# EAGLE design lamp_board_simple (EAGLE 7.2.0)
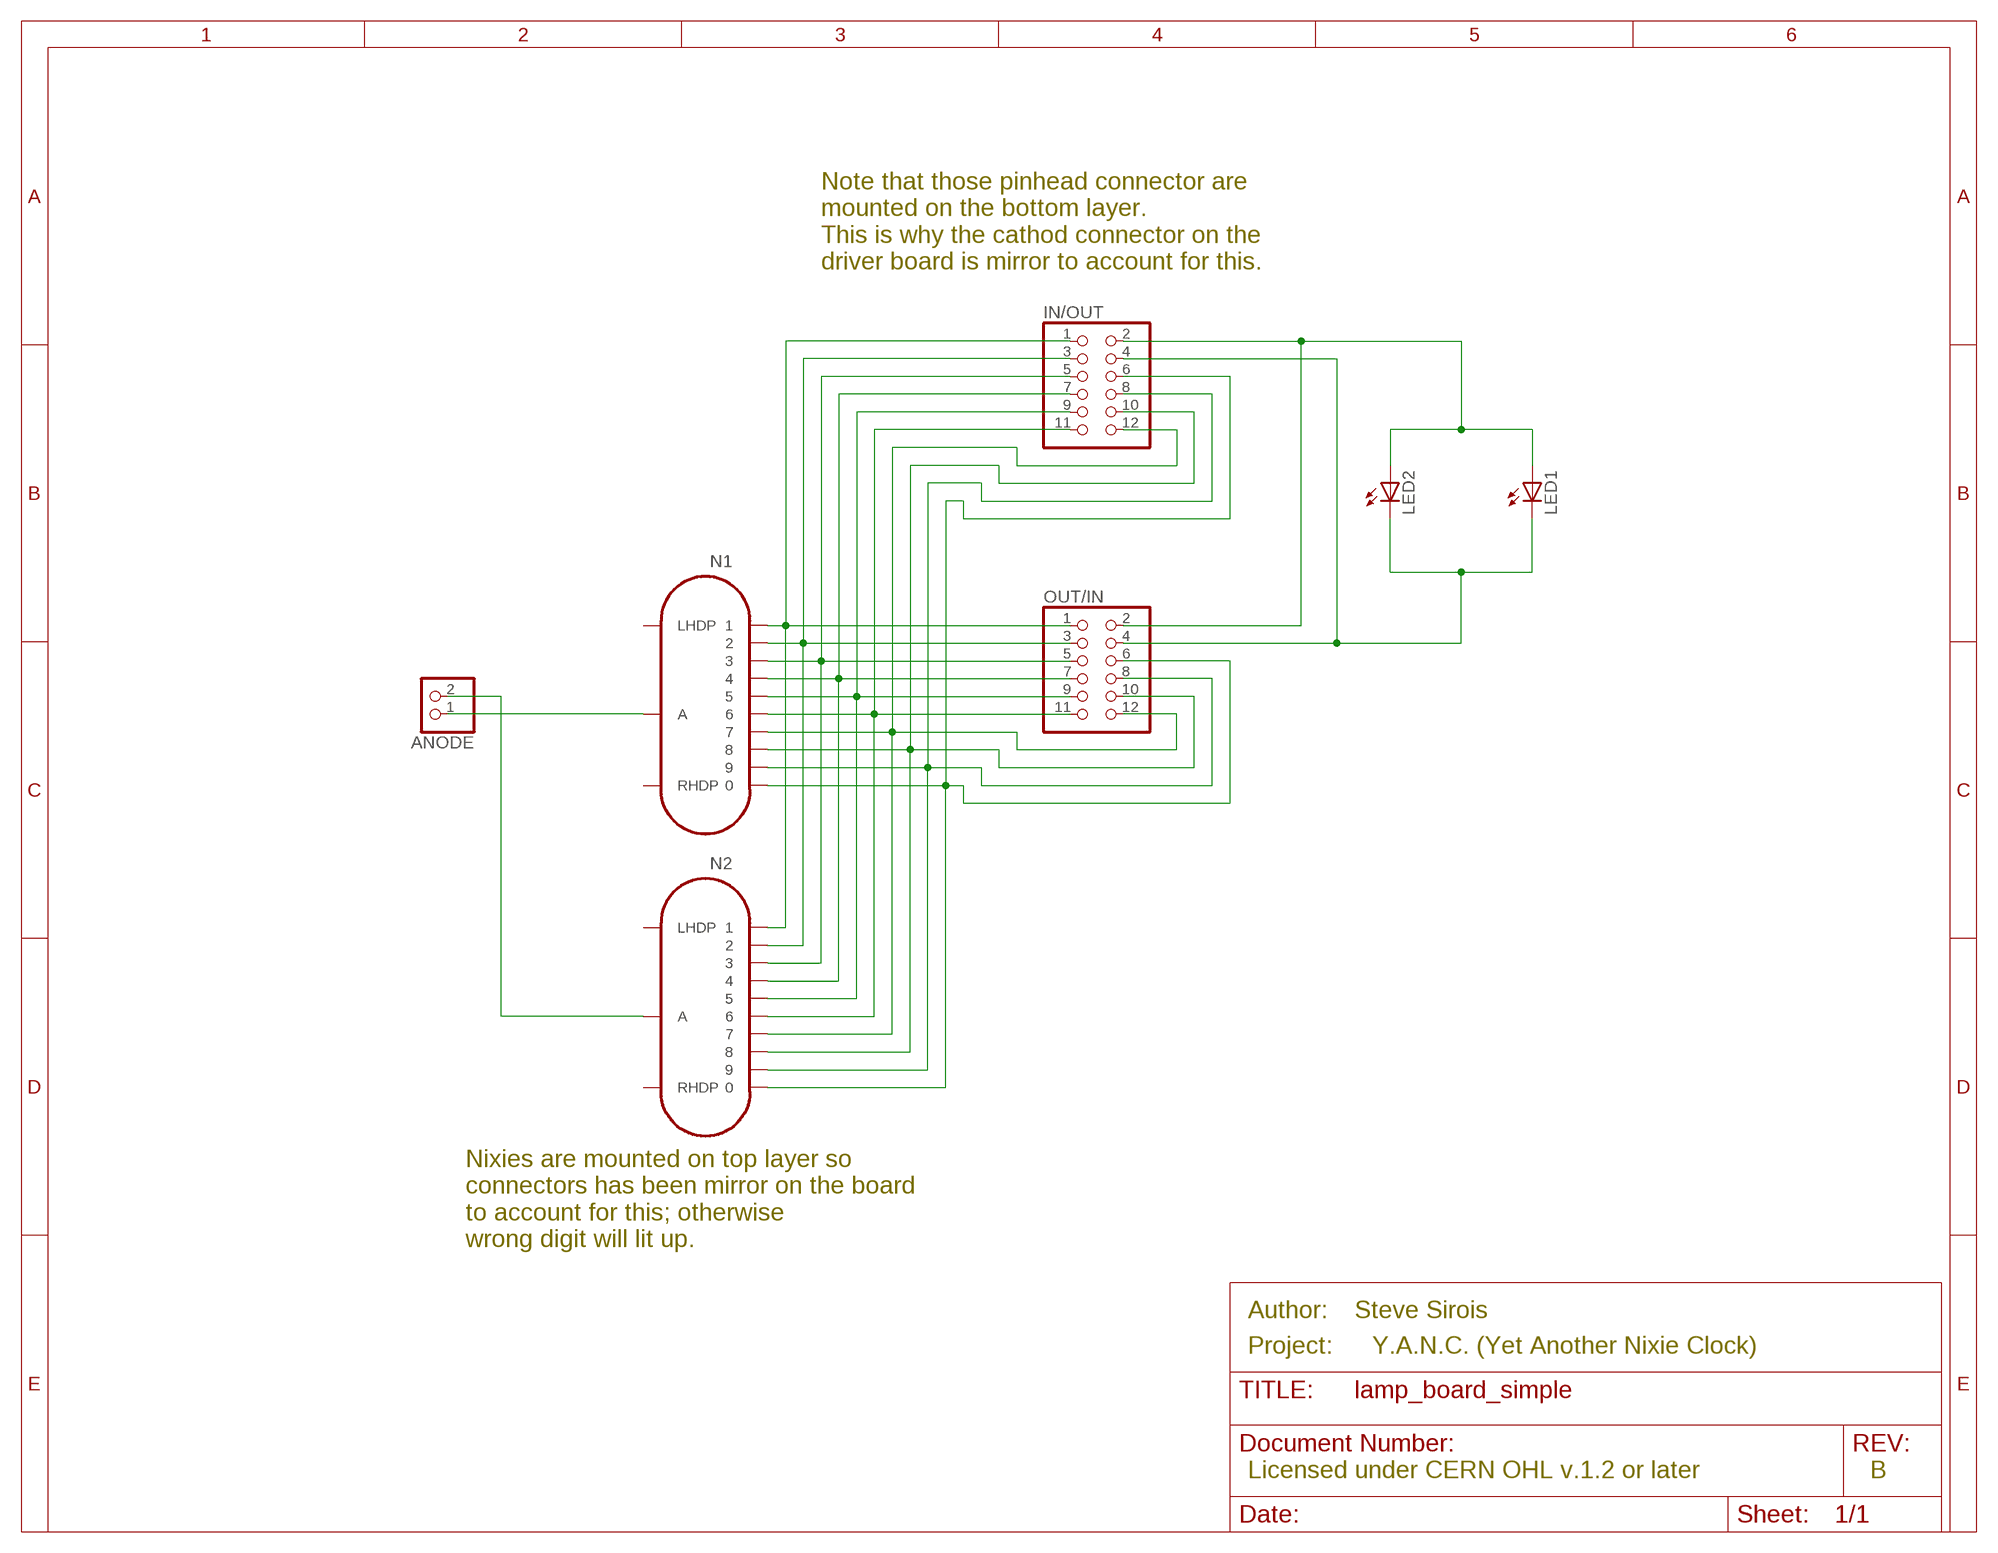
[diagram p0: schematic, sheet 1]

## Parts
ANODE  PINHD-1X2/90  [1X02/90]
IN/OUT  PINHD-2X6/90  [2X06/90]
LED1  LED5MM  [LED5MM]
LED2  LED5MM  [LED5MM]
N1  IN-14  [IN-14]
N2  IN-14  [IN-14]
OUT/IN  PINHD-2X6/90  [2X06/90]

## Nets
N$1: ANODE.1 N1.A
N$2: ANODE.2 N2.A
N$3: IN/OUT.4 LED1.K(C) LED2.K(C) OUT/IN.4
N$4: IN/OUT.2 LED1.A LED2.A OUT/IN.2
N$13: IN/OUT.1 N1.1 N2.1 OUT/IN.1
N$14: IN/OUT.3 N1.2 N2.2 OUT/IN.3
N$15: IN/OUT.5 N1.3 N2.3 OUT/IN.5
N$16: IN/OUT.7 N1.4 N2.4 OUT/IN.7
N$17: IN/OUT.9 N1.5 N2.5 OUT/IN.9
N$18: IN/OUT.11 N1.6 N2.6 OUT/IN.11
N$19: IN/OUT.12 N1.7 N2.7 OUT/IN.12
N$20: IN/OUT.10 N1.8 N2.8 OUT/IN.10
N$21: IN/OUT.8 N1.9 N2.9 OUT/IN.8
N$22: IN/OUT.6 N1.0 N2.0 OUT/IN.6
Unconnected: N1.LHDP N1.RHDP N2.LHDP N2.RHDP

## Notes on the sheet
- Note that those pinhead connector are
  mounted on the bottom layer. 
  This is why the cathod connector on the
  driver board is mirror to account for this.
- Nixies are mounted on top layer so
  connectors has been mirror on the board
  to account for this; otherwise
  wrong digit will lit up.
- Author: | Steve Sirois
- Project: | Y.A.N.C. (Yet Another Nixie Clock)
- Licensed under CERN OHL v.1.2 or later | B

## Library data of the parts
ANODE = pinhead:PINHD-1X2: PIN HEADER
IN/OUT OUT/IN = pinhead:PINHD-2X6: PIN HEADER
LED1 LED2 = led:LED: LED OSRAM: - CHIPLED LG R971, LG N971, LY N971, LG Q971, LY Q971, LO R971, LY R971 LH N974, LH R974 LS Q976, LO Q976, LY Q976 LO Q996 - Hyper CHIPLED LW Q18S LB Q993, LB Q99A, LB R99A - SideLED LS A670, LO A670, LY A670, LG A670, LP A670 LB A673, LV A673, LT A673, LW A673 LH A674 LY A675 LS A676, LA A676, LO A676, LY A676, LW A676 LS A679, LY A679, LG A679 - Hyper Micro SIDELED® LS Y876, LA Y876, LO Y876, LY Y876 LT Y87S - SmartLED LW L88C, LW L88S LB L89C, LB L89S, LG L890 LS L89K, LO L89K, LY L89K LS L896, LA L896, LO L896, LY L896 - TOPLED LS T670, LO T670, LY T670, LG T670, LP T670 LSG T670, LSP T670, LSY T670, LOP T670, LYG T670 LG T671, LOG T671, LSG T671 LB T673, LV T673, LT T673, LW T673 LH T674 LS T676, LA T676, LO T676, LY T676, LB T676, LH T676, LSB T676, LW T676 LB T67C, LV T67C, LT T67C, LS T67K, LO T67K, LY T67K, LW E67C LS E67B, LA E67B, LO E67B, LY E67B, LB E67C, LV E67C, LT E67C LW T67C LS T679, LY T679, LG T679 LS T770, LO T770, LY T770, LG T770, LP T770 LB T773, LV T773, LT T773, LW T773 LH T774 LS E675, LA E675, LY E675, LS T675 LS T776, LA T776, LO T776, LY T776, LB T776 LHGB T686 LT T68C, LB T68C - Hyper Mini TOPLED® LB M676 - Mini TOPLED Santana® LG M470 LS M47K, LO M47K, LY M47K Source: http://www.osram.convergy.de LUXEON: - LUMILED® LXK2-PW12-R00, LXK2-PW12-S00, LXK2-PW14-U00, LXK2-PW14-V00 LXK2-PM12-R00, LXK2-PM12-S00, LXK2-PM14-U00 LXK2-PE12-Q00, LXK2-PE12-R00, LXK2-PE12-S00, LXK2-PE14-T00, LXK2-PE14-U00 LXK2-PB12-K00, LXK2-PB12-L00, LXK2-PB12-M00, LXK2-PB14-N00, LXK2-PB14-P00, LXK2-PB14-Q00 LXK2-PR12-L00, LXK2-PR12-M00, LXK2-PR14-Q00, LXK2-PR14-R00 LXK2-PD12-Q00, LXK2-PD12-R00, LXK2-PD12-S00 LXK2-PH12-R00, LXK2-PH12-S00 LXK2-PL12-P00, LXK2-PL12-Q00, LXK2-PL12-R00 Source: www.luxeon.com KINGBRIGHT: KA-3528ASYC Source: www.kingbright.com
N1 N2 = russian-nixies:IN-14: IN-14: medium numeric frontview nixie tube

## Board
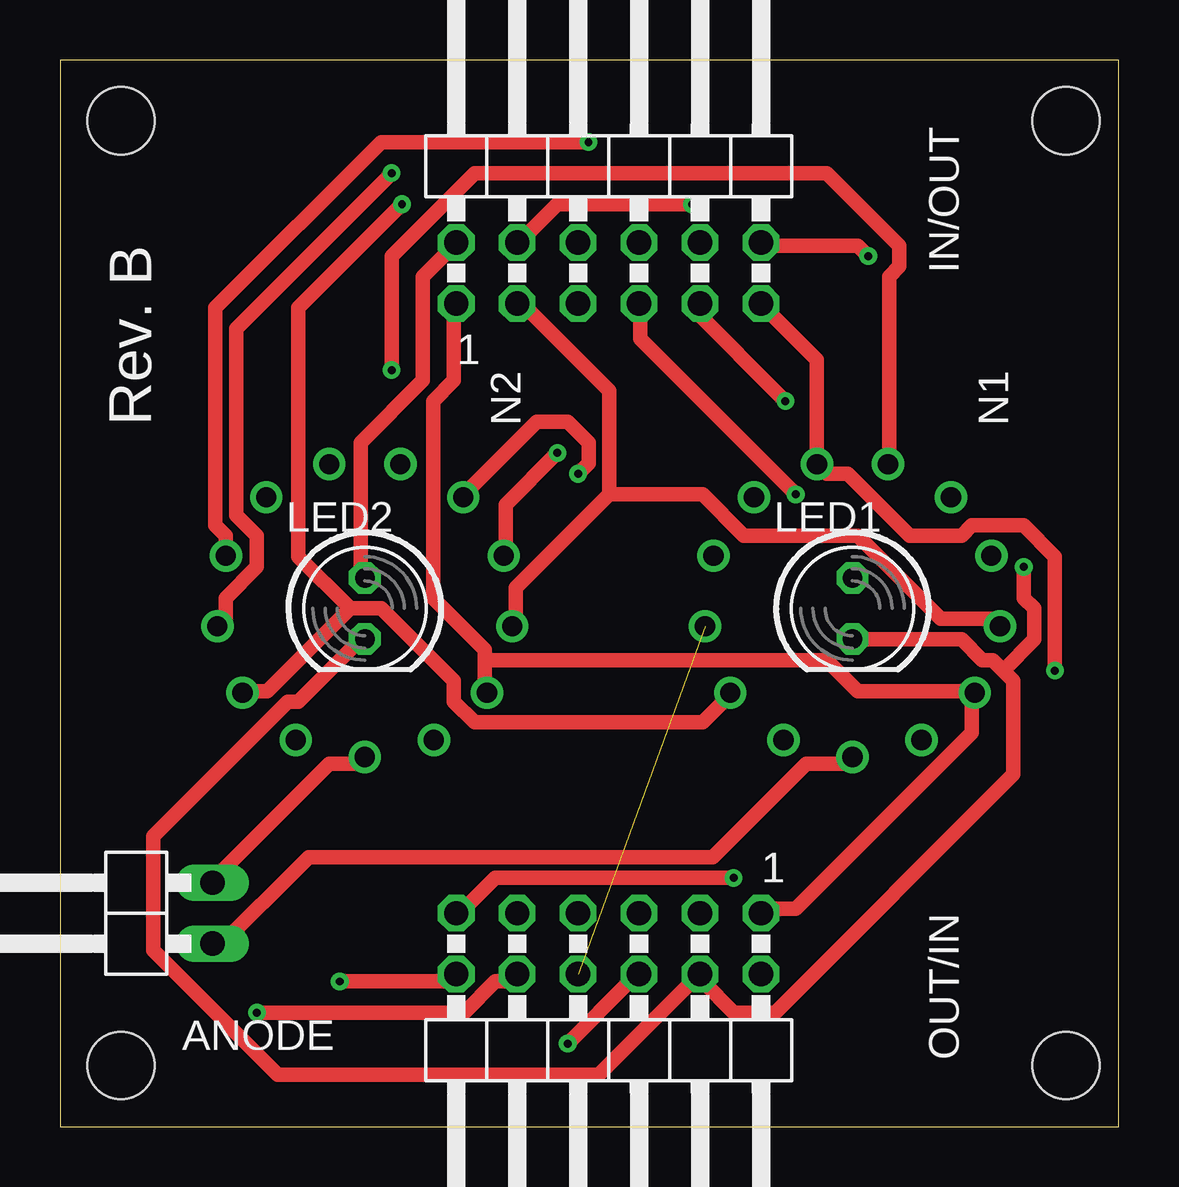
[diagram p1: board, top side]
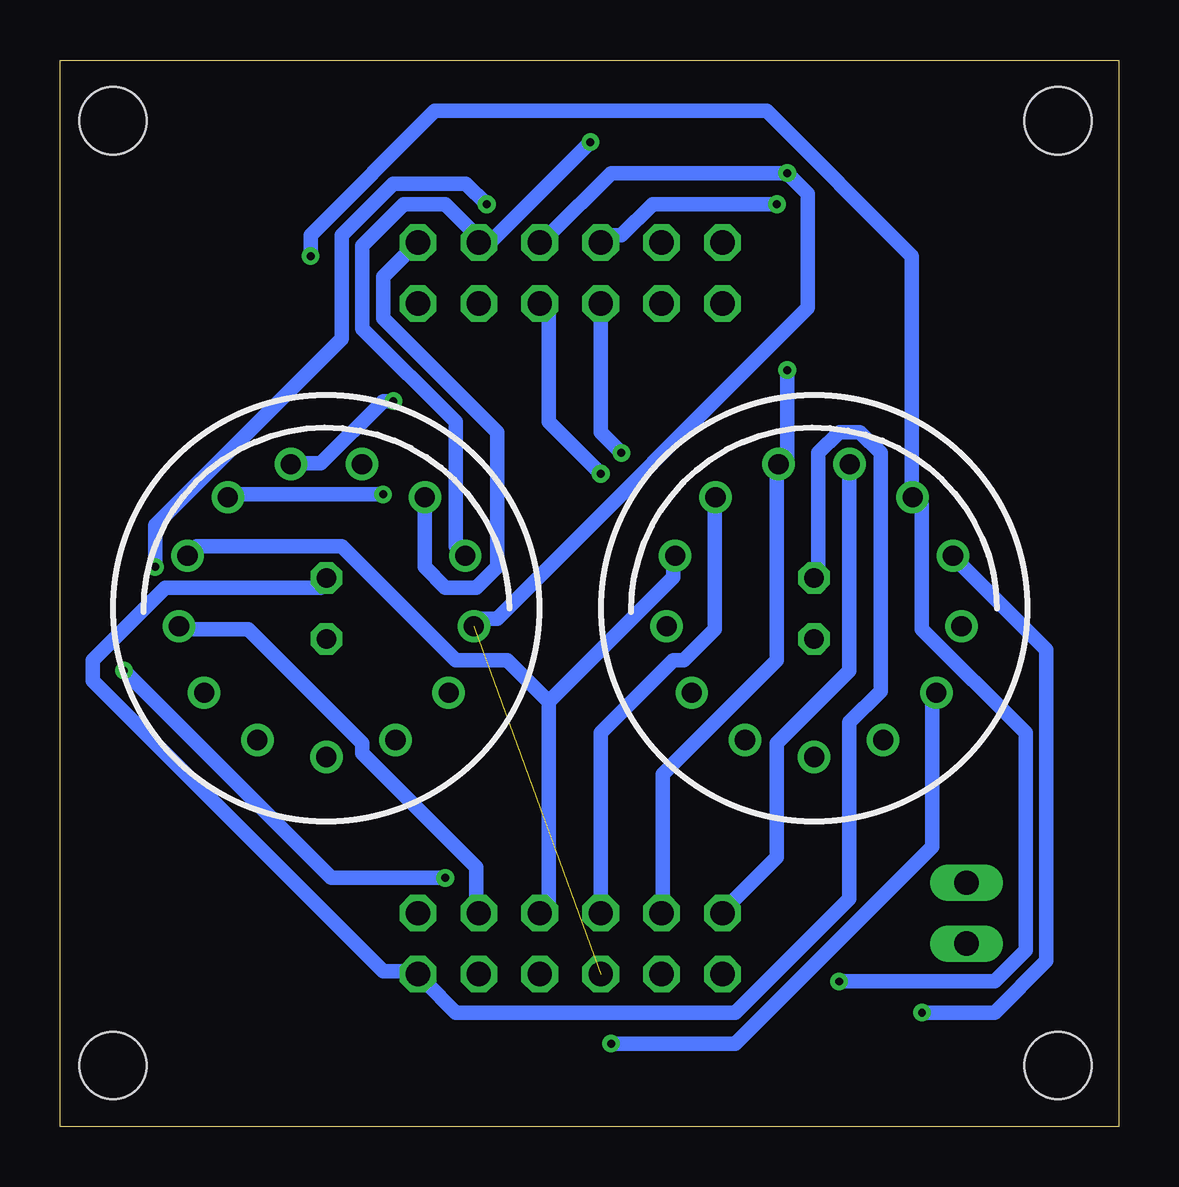
[diagram p2: board, bottom side, seen from below]

Size 44.12 x 44.44 mm. Coordinates in mm from the lower left corner, seen from the top.
Outline: 0,0 44.12,0 44.12,44.44 0,44.44 0,0
Copper layers (1*16): Top 0.035mm / dielectric 1.5mm / Bottom 0.035mm
Design rules "default *": minimum track width 24mil, minimum drill 13mil, track to track 10mil, track to pad 10mil, pad to pad 8mil, via to via 8mil, smd to smd 8mil, copper to edge 40mil, drill to drill 8mil, minimum pad ring 10mil, minimum via ring 8mil, stop-mask expansion 4mil, vias tented up to drill 0mil, thermal gap 10mil
Holes 2.8 mm at 2.54,41.91 41.91,41.91 41.91,2.54 2.54,2.54

### Footprints (pad centres in the part's own frame; a part is rotated, then mirrored left to right if it is on the bottom)
1X02/90 = drill 1.016 long: 1 -1.27,-3.81; 2 1.27,-3.81
2X06/90 = drill 1.016 octagon: 1 -6.35,-6.35; 2 -6.35,-3.81; 3 -3.81,-6.35; 4 -3.81,-3.81; 5 -1.27,-6.35; 6 -1.27,-3.81; 7 1.27,-6.35; 8 1.27,-3.81; 9 3.81,-6.35; 10 3.81,-3.81; 11 6.35,-6.35; 12 6.35,-3.81
LED5MM = drill 0.813 octagon: A -1.27,0; K 1.27,0
IN-14 = drill 0.84: 0 5.094,-3.516; 1 -5.094,-3.516; 2 -6.145,-0.746; 3 -5.788,2.195; 4 -4.105,4.633; 5 -1.481,6.01; 6 1.481,6.01; 7 4.105,4.633; 8 5.788,2.195; 9 6.145,-0.746; A 0,-6.19; LHDP 2.877,-5.481; RHDP -2.877,-5.481

### Placement (x,y rotation side)
ANODE  2.54,8.89 90 top
IN/OUT  22.86,40.64 0 top
LED1  33.02,21.59 270 top
LED2  12.7,21.59 270 top
N1  33.02,21.59 0 bottom
N2  12.7,21.59 0 bottom
OUT/IN  22.86,2.54 180 top

### Tracks (layer width: path | path; a pad name or v marks a point on that pad's centre or on a via)
N$1
  Top 0.61: N1.A 32.82,15.11 31.09,15.11 27.2,11.23 10.36,11.23 6.48,7.34 ANODE.1
N$2
  Top 0.61: N2.A 12.52,15.11 11.23,15.11 6.48,10.36 ANODE.2
N$3  (via drill 0.33)
  Top 0.61: LED2.K 12.52,20.3 9.93,17.7 9.5,17.7 3.89,12.09 3.89,7.34 9.07,2.16 22.45,2.16 26.34,6.04 OUT/IN.4 26.77,6.04 28.07,4.75 29.79,4.75 39.73,14.68 39.73,18.57 39.29,19 | 39.29,19 38.86,19.43 38.43,19.43 37.57,20.3 33.25,20.3 LED1.K | v26.34,38.43 20.73,38.43 19.43,37.13 IN/OUT.4 | v40.16,23.32 40.16,22.02 40.59,21.59 40.59,20.3 39.29,19
  Bottom 0.61: v26.34,38.43 27.2,39.29 30.23,39.29 32.38,37.13 32.38,32.82 40.16,25.04 v40.16,23.32
N$4
  Top 0.61: LED2.A 12.52,22.89 12.52,28.5 15.11,31.09 15.11,35.41 16.41,36.7 IN/OUT.2
  Bottom 0.61: LED1.A 33.25,22.45 39.73,22.45 42.75,19.43 42.75,18.57 30.66,6.48 29.36,6.48 OUT/IN.2 28.93,6.04 27.64,4.75 15.98,4.75 11.23,9.5 11.23,16.84 9.93,18.14 9.93,28.07 10.79,28.93 11.66,28.93 12.52,28.07 12.52,22.89 LED2.A
N$13
  Top 0.61: 17.7,19.43 17.7,19.86 15.54,22.02 15.54,30.23 16.41,31.09 16.41,34.11 IN/OUT.1 | 17.7,19.43 17.7,18.14 N2.1 | OUT/IN.1 29.36,9.07 30.66,9.07 38,16.41 38,17.7 N1.1 38,18.14 33.25,18.14 31.95,19.43 17.7,19.43
N$14
  Top 0.61: 22.89,26.34 19,22.45 19,21.16 N2.2 | 22.89,26.34 22.89,30.66 19.43,34.11 IN/OUT.3 | 22.89,26.34 26.77,26.34 28.5,24.61 33.25,24.61 36.7,21.16 38.86,21.16 N1.2
  Bottom 0.61: OUT/IN.3 26.77,9.07 26.77,10.79 31.52,15.54 31.52,15.98 36.27,20.73 38.86,20.73 N1.2
N$15  (via drill 0.33)
  Top 0.61: v20.73,28.07 18.57,25.91 18.57,24.18 N2.3
  Bottom 0.61: 23.75,17.7 18.57,22.89 18.57,23.75 N2.3 | 23.75,17.7 23.75,9.07 OUT/IN.5 | 23.75,17.7 25.48,19.43 27.64,19.43 32.38,24.18 38.43,24.18 N1.3 | IN/OUT.5 21.59,28.93 v20.73,28.07
N$16  (via drill 0.33)
  Top 0.61: v30.66,26.34 24.18,32.82 24.18,34.11 IN/OUT.7 | v21.59,27.2 22.02,27.64 22.02,28.5 21.16,29.36 19.86,29.36 16.84,26.34 N2.4
  Bottom 0.61: v30.66,26.34 36.7,26.34 N1.4 | OUT/IN.7 21.59,16.41 18.57,19.43 18.14,19.43 16.84,20.73 16.84,25.91 N2.4 | v21.59,27.2 23.75,29.36 23.75,34.11 IN/OUT.7
N$17  (via drill 0.33)
  Top 0.61: v30.23,30.23 26.34,34.11 IN/OUT.9 | v13.82,31.52 13.82,36.27 17.27,39.73 31.95,39.73 34.98,36.7 34.98,35.84 34.54,35.41 34.54,27.64 N1.5
  Bottom 0.61: v30.23,30.23 30.66,30.23 33.25,27.64 34.11,27.64 N1.5 | OUT/IN.9 19,9.07 19,14.68 14.25,19.43 14.25,27.2 N2.5 13.82,27.64 v13.82,31.52
N$18  (via drill 0.33)
  Top 0.61: IN/OUT.11 29.36,34.11 31.52,31.95 31.52,27.64 N1.6 31.95,27.2 32.82,27.2 35.41,24.61 37.57,24.61 38,25.04 40.16,25.04 41.45,23.75 v41.45,19 | v28.07,10.36 18.14,10.36 16.84,9.07 OUT/IN.11
  Bottom 0.61: N2.6 11.23,27.2 11.23,19 14.25,15.98 14.25,11.23 16.41,9.07 OUT/IN.11 | v41.45,19 32.82,10.36 v28.07,10.36
N$19  (via drill 0.33)
  Top 0.61: v11.66,6.04 16.41,6.04 OUT/IN.12 | v33.68,36.27 33.25,36.7 29.36,36.7 IN/OUT.12
  Bottom 0.61: N1.7 28.93,25.91 28.93,23.32 28.07,22.45 26.77,22.45 25.91,23.32 25.91,28.93 30.66,33.68 30.66,35.41 29.36,36.7 IN/OUT.12 | v11.66,6.04 5.18,6.04 3.89,7.34 3.89,16.41 8.2,20.73 8.2,25.91 N2.7 8.64,26.34 8.64,36.27 14.68,42.32 28.5,42.32 33.68,37.13 v33.68,36.27
N$20  (via drill 0.33)
  Top 0.61: v22.02,41.02 13.39,41.02 6.48,34.11 6.48,25.04 6.91,24.61 6.91,24.18 N2.8 | v8.2,4.75 16.84,4.75 18.14,6.04 19,6.04 OUT/IN.10
  Bottom 0.61: v22.02,41.02 26.34,36.7 IN/OUT.10 26.77,37.13 28.07,38.43 29.79,38.43 31.52,36.7 31.52,33.25 27.64,29.36 27.64,24.18 N1.8 | v8.2,4.75 5.18,4.75 3.02,6.91 3.02,19.86 6.91,23.75 N2.8
N$21  (via drill 0.33)  (1 unrouted)
  Top 0.61: v13.82,39.73 7.34,33.25 7.34,25.48 8.2,24.61 8.2,23.32 6.91,22.02 6.91,21.16 N2.9
  Bottom 0.61: IN/OUT.8 23.75,37.13 21.16,39.73 v13.82,39.73 12.95,38.86 12.95,34.11 25.91,21.16 26.77,21.16 N1.9
N$22  (via drill 0.33)
  Top 0.61: 12.09,21.59 8.64,18.14 7.77,18.14 N2.0 | 12.09,21.59 13.39,21.59 16.41,18.57 16.41,17.7 17.27,16.84 26.77,16.84 27.64,17.7 N1.0 | v21.16,3.45 23.75,6.04 OUT/IN.6 | v14.25,38.43 9.93,34.11 9.93,23.75 12.09,21.59
  Bottom 0.61: v21.16,3.45 15.98,3.45 7.77,11.66 7.77,17.7 N2.0 | v14.25,38.43 19.43,38.43 20.73,37.13 21.59,37.13 IN/OUT.6

### Text on the board
tPlace: 1 | Rev. B | 1